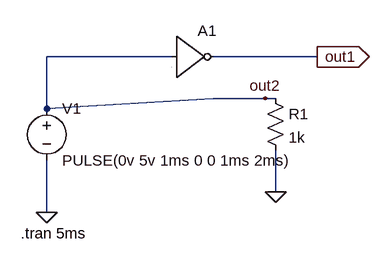
[diagram p0: schematic test1.asc]
test1.asc, the LTspice schematic file:
Version 4
SHEET 1 880 680
WIRE -144 -64 -336 -64
WIRE 80 -64 -80 -64
WIRE 0 0 -80 0
WIRE 16 0 0 0
WIRE -336 16 -336 -64
WIRE -336 16 -80 0
WIRE 16 144 16 80
WIRE -336 176 -336 96
FLAG -336 176 0
FLAG 16 144 0
FLAG 0 0 out2
FLAG 80 -64 out1
IOPIN 80 -64 Out
SYMBOL res 0 -16 R0
SYMATTR InstName R1
SYMATTR Value 1k
SYMBOL voltage -336 0 R0
WINDOW 123 0 0 Left 2
WINDOW 39 0 0 Left 2
SYMATTR InstName V1
SYMATTR Value PULSE(0v 5v 1ms 0 0 1ms 2ms)
SYMBOL Digital\\inv -144 -128 R0
SYMATTR InstName A1
TEXT -376 208 Left 2 !.tran 5ms

The netlist it stands for:
* test1.asc
R1 out2 0 1k
V1 out2 0 PULSE(0v 5v 1ms 0 0 1ms 2ms)
A1 out2 0 0 0 0 out1 0 0 BUF
.tran 5ms
.backanno
.end